# Altium schematic sheet SimpleFOCShieldV3.SchDoc_2024-06-23.schdoc
size 547 x 393 mm
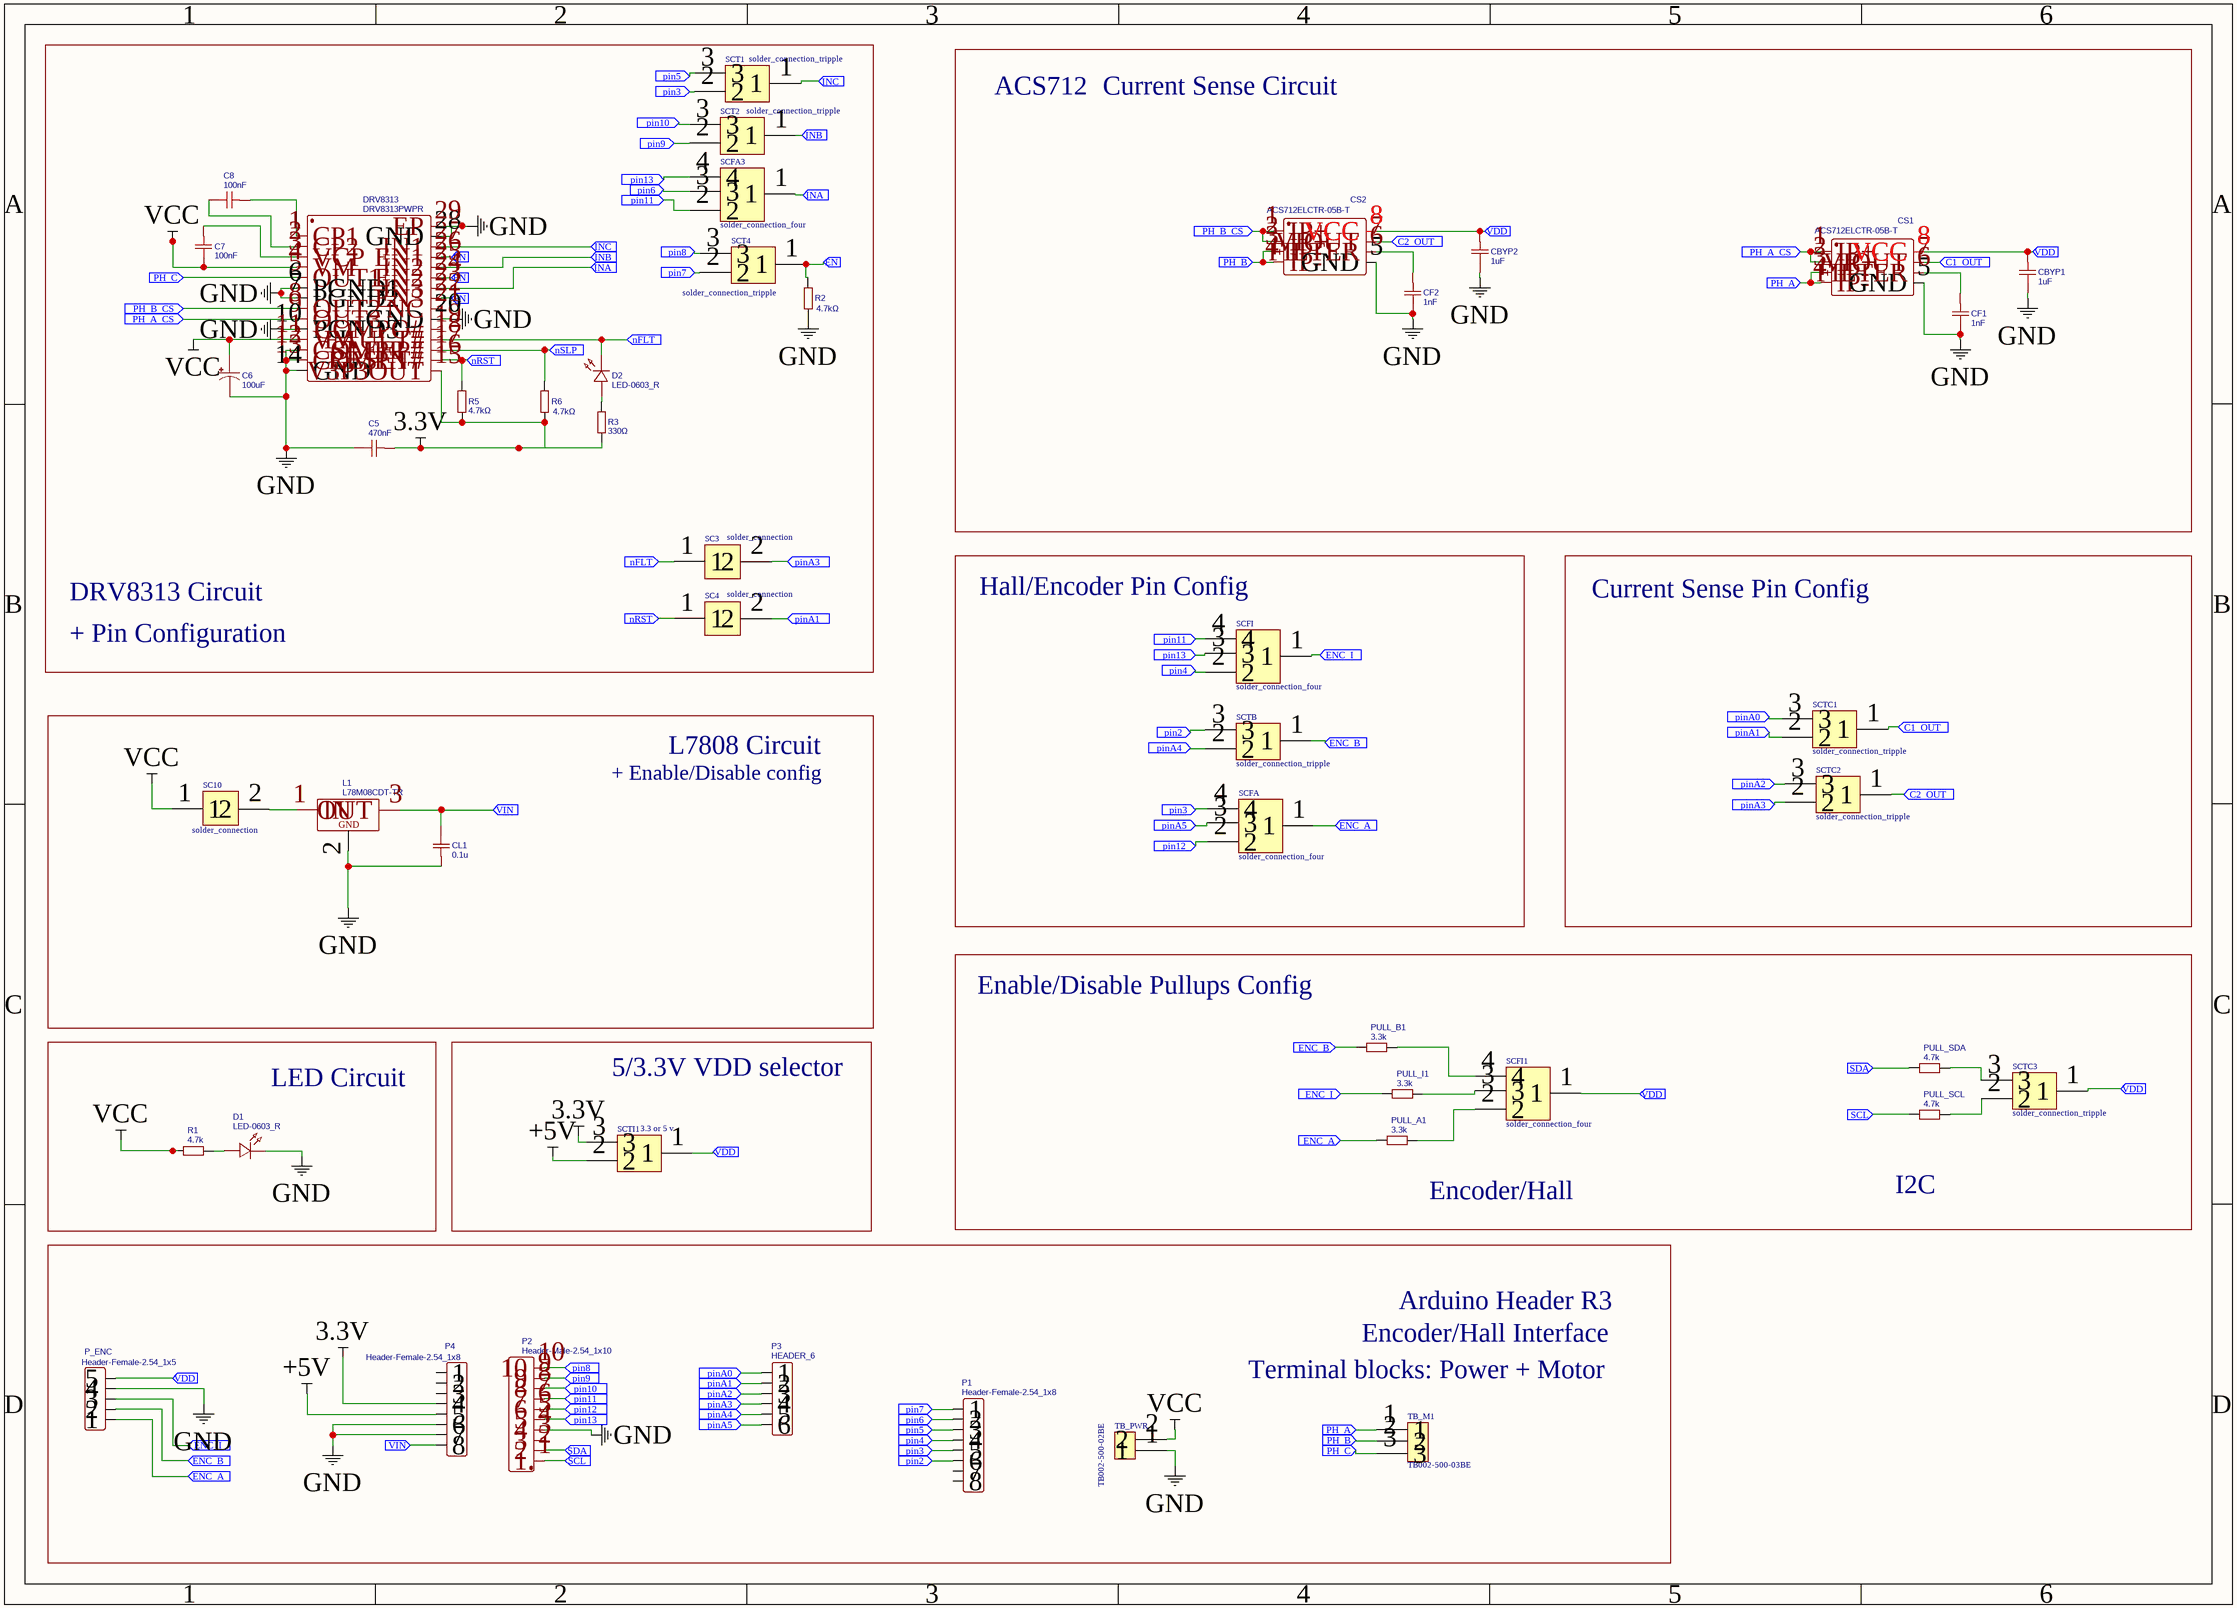
[diagram p0: SimpleFOCShieldV3.SchDoc_2024-06-23.schdoc]

## Parts
C5  470nF  [C0603]
C6  100uF  [CAP-SMD_BD6.3-L6.6-W6.6-FD]
C7  100nF  [C0603]
C8  100nF  [C0603]
CBYP1  1uF  [C0603]
CBYP2  1uF  [C0603]
CF1  1nF  [C0603]
CF2  1nF  [C0603]
CL1  0.1u  [C0603]
CS1  ACS712ELCTR-05B-T  [SOIC-8_L5.0-W4.0-P1.27-LS6.0-BL]
CS2  ACS712ELCTR-05B-T  [SOIC-8_L5.0-W4.0-P1.27-LS6.0-BL]
D1  LED-0603_R  [LED0603_RED]
D2  LED-0603_R  [LED0603_RED]
DRV8313  DRV8313PWPR  [HTSSOP-28_L9.8-W4.5-P0.65-LS6.6-BL-EP]
L1  L78M08CDT-TR  [TO-252-2_L6.6-W6.1-P4.57-LS9.9-TL-CW]
P1  Header-Female-2.54_1x8  [HDR-TH_8P-P2.54-V-F-1]
P2  Header-Male-2.54_1x10  [HDR-TH_10P-P2.54-V-M-1]
P3  HEADER_6  [HDR-M-2.54_1X6]
P4  Header-Female-2.54_1x8  [HDR-TH_8P-P2.54-V-F-1]
P_ENC  Header-Female-2.54_1x5  [HDR-TH_5P-P2.54-V-F]
PULL_A1  3.3k  [R0603]
PULL_B1  3.3k  [R0603]
PULL_I1  3.3k  [R0603]
PULL_SCL  4.7k  [R0603]
PULL_SDA  4.7k  [R0603]
R1  4.7k  [R0603]
R2  4.7kΩ  [R0603]
R3  330Ω  [R0603]
R5  4.7kΩ  [R0603]
R6  4.7kΩ  [R0603]
SC3  solder_connection  [SOLDER_CONNECTION]
SC4  solder_connection  [SOLDER_CONNECTION]
SC10  solder_connection  [SOLDER_CONNECTION]
SCFA  solder_connection_four  [SOLDER_CONNECTION_FOUR]
SCFA3  solder_connection_four  [SOLDER_CONNECTION_FOUR]
SCFI  solder_connection_four  [SOLDER_CONNECTION_FOUR]
SCFI1  solder_connection_four  [SOLDER_CONNECTION_FOUR]
SCT1  solder_connection_tripple  [SOLDER_CONNECTION_TRIPPLE]
SCT2  solder_connection_tripple  [SOLDER_CONNECTION_TRIPPLE]
SCT4  solder_connection_tripple  [SOLDER_CONNECTION_TRIPPLE]
SCTB  solder_connection_tripple  [SOLDER_CONNECTION_TRIPPLE]
SCTC1  solder_connection_tripple  [SOLDER_CONNECTION_TRIPPLE]
SCTC2  solder_connection_tripple  [SOLDER_CONNECTION_TRIPPLE]
SCTC3  solder_connection_tripple  [SOLDER_CONNECTION_TRIPPLE]
SCTI1  3.3 or 5 v  [SOLDER_CONNECTION_TRIPPLE]
TB_M1  TB002-500-03BE  [TB002-500-03BE]
TB_PWR  TB002-500-02BE  [TB002-500-02BE]

## Blocks framed on the sheet
Hall/Encoder Pin Config: SCFA SCFI SCTB
Current Sense Pin Config: SCTC1 SCTC2
L7808 Circuit: CL1 L1 SC10
LED Circuit: D1 R1
5/3.3V VDD selector: SCTI1

## Ports
C1_OUT (in), C2_OUT (in), EN (in), ENC_A (in), ENC_B (in), ENC_I (in), INA (in), INB (in), INC (in), nFLT (in), nRST (in), nSLP (in), PH_A (in), PH_A_CS (in), PH_B (in), PH_B_CS (in), PH_C (in), pin2 (in), pin3 (in), pin4 (in), pin5 (in), pin6 (in), pin7 (in), pin8 (in), pin9 (in), pin10 (in), pin11 (in), pin12 (in), pin13 (in), pinA0 (in), pinA1 (in), pinA2 (in), pinA3 (in), pinA4 (in), pinA5 (in), SCL (in), SDA (in), VDD (in), VIN (in)

## Nets
3.3V: C5.2 DRV8313.15(V3P3OUT) P4.4 R3.1 R5.1 R6.1 SCTI1.3
+5V: P4.5 SCTI1.2
GND: C5.1 C6.2 CBYP1.1 CBYP2.1 CF1.1 CF2.1 CL1.2 CS1.5(GND) CS2.5(GND) D1.2 DRV8313.6(PGND1) DRV8313.7(PGND2) DRV8313.10(PGND3) DRV8313.12(COMPP) DRV8313.13(COMPN) DRV8313.14(GND) DRV8313.20(GND) DRV8313.28(GND) DRV8313.29(EP) L1.2(GND) P2.4 P4.6 P4.7 P_ENC.4 R2.1 TB_PWR.1
VCC: C6.1 C7.1 DRV8313.4(VM) DRV8313.11(VM) R1.2 SC10.1 TB_PWR.2
C1_OUT: CS1.7(VIOUT) SCTC1.1 ; port C1_OUT
C2_OUT: CS2.7(VIOUT) SCTC2.1 ; port C2_OUT
EN: DRV8313.22(EN3) DRV8313.24(EN2) DRV8313.26(EN1) R2.2 SCT4.1 ; port EN
ENC_A: P_ENC.1 PULL_A1.2 SCFA.1 ; port ENC_A
ENC_B: P_ENC.2 PULL_B1.2 SCTB.1 ; port ENC_B
ENC_I: P_ENC.3 PULL_I1.2 SCFI.1 ; port ENC_I
INA: DRV8313.23(IN3) SCFA3.1 ; port INA
INB: DRV8313.25(IN2) SCT2.1 ; port INB
INC: DRV8313.27(IN1) SCT1.1 ; port INC
nFLT: D2.2 DRV8313.18(FAULT#) SC3.1 ; port nFLT
nRST: DRV8313.16(RESET#) R5.2 SC4.1 ; port nRST
nSLP: DRV8313.17(SLEEP#) R6.2 ; port nSLP
PH_A: CS1.3(IP-) CS1.4(IP-) TB_M1.1 ; port PH_A
PH_A_CS: CS1.1(IP+) CS1.2(IP+) DRV8313.9(OUT3) ; port PH_A_CS
PH_B: CS2.3(IP-) CS2.4(IP-) TB_M1.2 ; port PH_B
PH_B_CS: CS2.1(IP+) CS2.2(IP+) DRV8313.8(OUT2) ; port PH_B_CS
PH_C: DRV8313.5(OUT1) TB_M1.3 ; port PH_C
pin2: P1.6 SCTB.3 ; port pin2
pin3: P1.5 SCFA.4 SCT1.2 ; port pin3
pin4: P1.4 SCFI.2 ; port pin4
pin5: P1.3 SCT1.3 ; port pin5
pin6: P1.2 SCFA3.3 ; port pin6
pin7: P1.1 SCT4.2 ; port pin7
pin8: P2.10 SCT4.3 ; port pin8
pin9: P2.9 SCT2.2 ; port pin9
pin10: P2.8 SCT2.3 ; port pin10
pin11: P2.7 SCFA3.2 SCFI.4 ; port pin11
pin12: P2.6 SCFA.2 ; port pin12
pin13: P2.5 SCFA3.4 SCFI.3 ; port pin13
pinA0: P3.1 SCTC1.3 ; port pinA0
pinA1: P3.2 SC4.2 SCTC1.2 ; port pinA1
pinA2: P3.3 SCTC2.3 ; port pinA2
pinA3: P3.4 SC3.2 SCTC2.2 ; port pinA3
pinA4: P3.5 SCTB.2 ; port pinA4
pinA5: P3.6 SCFA.3 ; port pinA5
SCL: P2.1 PULL_SCL.2 ; port SCL
SDA: P2.2 PULL_SDA.2 ; port SDA
VDD: CBYP1.2 CBYP2.2 CS1.8(VCC) CS2.8(VCC) P_ENC.5 SCFI1.1 SCTC3.1 SCTI1.1 ; port VDD
VIN: CL1.1 L1.3(OUT) P4.8 ; port VIN
NetC7_2: C7.2 DRV8313.3(VCP)
NetC8_1: C8.1 DRV8313.2(CP2)
NetC8_2: C8.2 DRV8313.1(CP1)
NetCF1_2: CF1.2 CS1.6(FILTER)
NetCF2_2: CF2.2 CS2.6(FILTER)
NetD1_1: D1.1 R1.1
NetD2_1: D2.1 R3.2
NetL1_1: L1.1(IN) SC10.2
NetPULL_A1_1: PULL_A1.1 SCFI1.2
NetPULL_B1_1: PULL_B1.1 SCFI1.4
NetPULL_I1_1: PULL_I1.1 SCFI1.3
NetPULL_SCL_1: PULL_SCL.1 SCTC3.2
NetPULL_SDA_1: PULL_SDA.1 SCTC3.3

Not connected (* = marked no-connect by the designer): DRV8313 19(COMPO#) 21(NC); P1 7 8; P2 3; P4 1 2 3

## Notes on the sheet
- ACS712
- Current Sense Circuit
- DRV8313 Circuit
- + Pin Configuration
- + Enable/Disable config
- Enable/Disable Pullups Config
- Encoder/Hall
- I2C
- Arduino Header R3
- Encoder/Hall Interface
- Terminal blocks: Power + Motor

## Library data of the parts
C5 = 470nF: Manufacturer: YAGEO; Manufacturer Part: CC0603ZRY5V6BB474; nameAlias: Capacitance; Contributor: LCSC; Supplier: LCSC; Supplier Part: C327269; spicePre: C; spiceSymbolName: CC0603ZRY5V6BB474
C6 = 100uF: Manufacturer: Vertical Technology; Manufacturer Part: VT1V101M-CRE77; nameAlias: Capacitance; Contributor: LCSC; Supplier: LCSC; Supplier Part: C294520; spicePre: C; spiceSymbolName: VT1V101M-CRE77
C7 C8 = 100nF: Manufacturer: SAMSUNG; Manufacturer Part: CL10B104KB8NNNC; nameAlias: Capacitance; Supplier: LCSC; Supplier Part: C1591; spicePre: C; spiceSymbolName: CL10B104KB8NNNC
CBYP1 CBYP2 = 1uF: nameAlias: Value(F); Contributor: LCEDA_Lib; spicePre: C; spiceSymbolName: C_0603_US
CF1 CF2 = 1nF: nameAlias: Value(F); Contributor: LCEDA_Lib; spicePre: C; spiceSymbolName: C_0603_US
CL1 = 0.1u: nameAlias: Value(F); Contributor: LCEDA_Lib; spicePre: C; spiceSymbolName: C_0603_US
CS1 CS2 = ACS712ELCTR-05B-T: Manufacturer: ALLEGRO(美国埃戈罗); spicePre: X; Supplier: LCSC; Manufacturer Part: ACS712ELCTR-05B-T; Supplier Part: C44471; JLCPCB Part Class: Extended Part; spiceSymbolName: ACS712ELCTR-05B-T
D1 D2 = LED-0603_R: Manufacturer: EVERLIGHT(台湾亿光); Manufacturer Part: 19-217/R6C-AL1M2VY/3T; Contributor: LCEDA_01; Supplier Part: C72044; spicePre: L; spiceSymbolName: LED-0603_R
  D1: Supplier: LCSC
  D2: Supplier: Add New Supplier
DRV8313 = DRV8313PWPR: Manufacturer: Texas Instruments; Contributor: LCSC; Supplier: LCSC; Supplier Part: C92482; Manufacturer Part: DRV8313PWPR; JLCPCB Part Class: Extended Part; spicePre: U; spiceSymbolName: DRV8313PWPR
L1 = L78M08CDT-TR: Manufacturer: STMicroelectronics; Contributor: LCSC; Supplier: LCSC; Manufacturer Part: L78M08CDT-TR; Supplier Part: C158076; JLCPCB Part Class: Extended Part; spicePre: U; spiceSymbolName: L78M08CDT-TR
P1 P4 = Header-Female-2.54_1x8: Manufacturer: BOOMELE; Manufacturer Part: Female headerHDR1X8-2.54; Supplier: LCSC; Supplier Part: C27438; JLCPCB Part Class: Extended Part; spicePre: P; spiceSymbolName: Header-Female-2.54_1x8
P2 = Header-Male-2.54_1x10: Manufacturer Part: Headers  Pins2.54mm1*10P; Supplier: LCSC; Supplier Part: C57369; JLCPCB Part Class: Extended Part; spicePre: H; spiceSymbolName: Header-Male-2.54_1x10
P_ENC = Header-Female-2.54_1x5: Manufacturer: BOOMELE; Manufacturer Part: 2.54mm 1*5p Female header; Supplier: LCSC; Supplier Part: C50950; JLCPCB Part Class: Extended Part; spicePre: H; spiceSymbolName: Header-Female-2.54_1x5
PULL_A1 PULL_B1 PULL_I1 = 3.3k: nameAlias: Resistance; Resistance (Ohms): 3.3k; JLCPCB Part Class: Basic Part; spicePre: R; spiceSymbolName: 0603WAF4701T5E
  PULL_B1: Supplier: LCSC
PULL_SCL PULL_SDA R1 = 4.7k: Manufacturer: UniOhm; Manufacturer Part: 0603WAF4701T5E; nameAlias: Resistance; Supplier: LCSC; Supplier Part: C23162; Resistance (Ohms): 4.7K; JLCPCB Part Class: Basic Part; spicePre: R; spiceSymbolName: 0603WAF4701T5E
R2 R5 R6 = 4.7kΩ: Manufacturer: UniOhm; Manufacturer Part: 0603WAF4701T5E; nameAlias: Resistance; Resistance (Ohms): 4.7K; Supplier: LCSC; Supplier Part: C23162; JLCPCB Part Class: Basic Part; spicePre: R; spiceSymbolName: 0603WAF4701T5E
R3 = 330Ω: nameAlias: Resistance; Resistance (Ohms): 330; JLCPCB Part Class: Basic Part; spicePre: R; spiceSymbolName: 0603WAF4701T5E
SCTC1 = solder_connection_tripple: Package Display: No
SCTI1 = 3.3 or 5 v: Package Display: No
P3 = HEADER_6: spicePre: J; spiceSymbolName: HEADER_6
TB_M1 = TB002-500-03BE: Supplier 1: Mouser; Supplier Part Number 1: 490-TB002-500-03BE
TB_PWR = TB002-500-02BE: Supplier 1: Mouser; Supplier Part Number 1: 490-TB002-500-02BE